# Altium schematic sheet Motor_Output.SchDoc
size A4; SheetNumber: 6; SheetTotal: 9
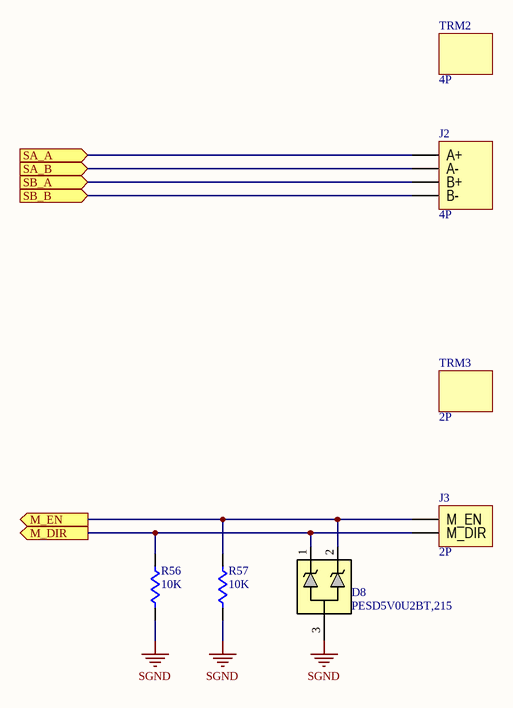
[diagram p0: Motor_Output.SchDoc]

## Parts
D8  PESD5V0U2BT,215  [SOT23_3]
J2  4P  [691313510004]
J3  2P  [691313510002]
R56  10K  [RES: 0603]
R57  10K  [RES: 0603]
TRM2  4P  (mechanical)
TRM3  2P  (mechanical)

## Ports
M_DIR (out), M_EN (out), SA_A (in), SA_B (in), SB_A (in), SB_B (in)

## Nets
SGND: D8.3(CC) R56.2 R57.2
M_DIR: D8.1(K1) J3.1(M_DIR) R56.1 ; port M_DIR
M_EN: D8.2(K2) J3.2(M_EN) R57.1 ; port M_EN
SA_A: J2.1(A+) ; port SA_A
SA_B: J2.2(A-) ; port SA_B
SB_A: J2.3(B+) ; port SB_A
SB_B: J2.4(B-) ; port SB_B

## Notes on the sheet
- Size:
- Date:
- Sheet Name:
- A4
- Sheet
- Time:
- of
- Author :
- Hatim Saad
- Project:
- File:

## Library data of the parts
D8 = PESD5V0U2BT,215: ESD Protection Diodes / TVS Diodes ESD 5V BI; Supplier 1: Mouser; Supplier Part Number 1: 771-PESD5V0U2BTT/R
J2 = 691313510004: Pluggable Terminal Blocks WR-TBL 300VAC 20A 4P Right Angle; Supplier 1: Mouser; Supplier Part Number 1: 710-691313510004
J3 = 691313510002: Pluggable Terminal Blocks WR-TBL 300VAC 20A 2P Right Angle; Supplier 1: Mouser; Supplier Part Number 1: 710-691313510002
R56 R57 = RES 0603: RES SMD 0603
TRM2 = 691351500004: Pluggable Terminal Blocks WR-TBL 300VAC 20A 4P Right Angle; Supplier 1: Mouser; Supplier Part Number 1: 710-691351500004
TRM3 = 691351500002: Pluggable Terminal Blocks WR-TBL 300VAC 20A 2P Right Angle; Supplier 1: Mouser; Supplier Part Number 1: 710-691351500002